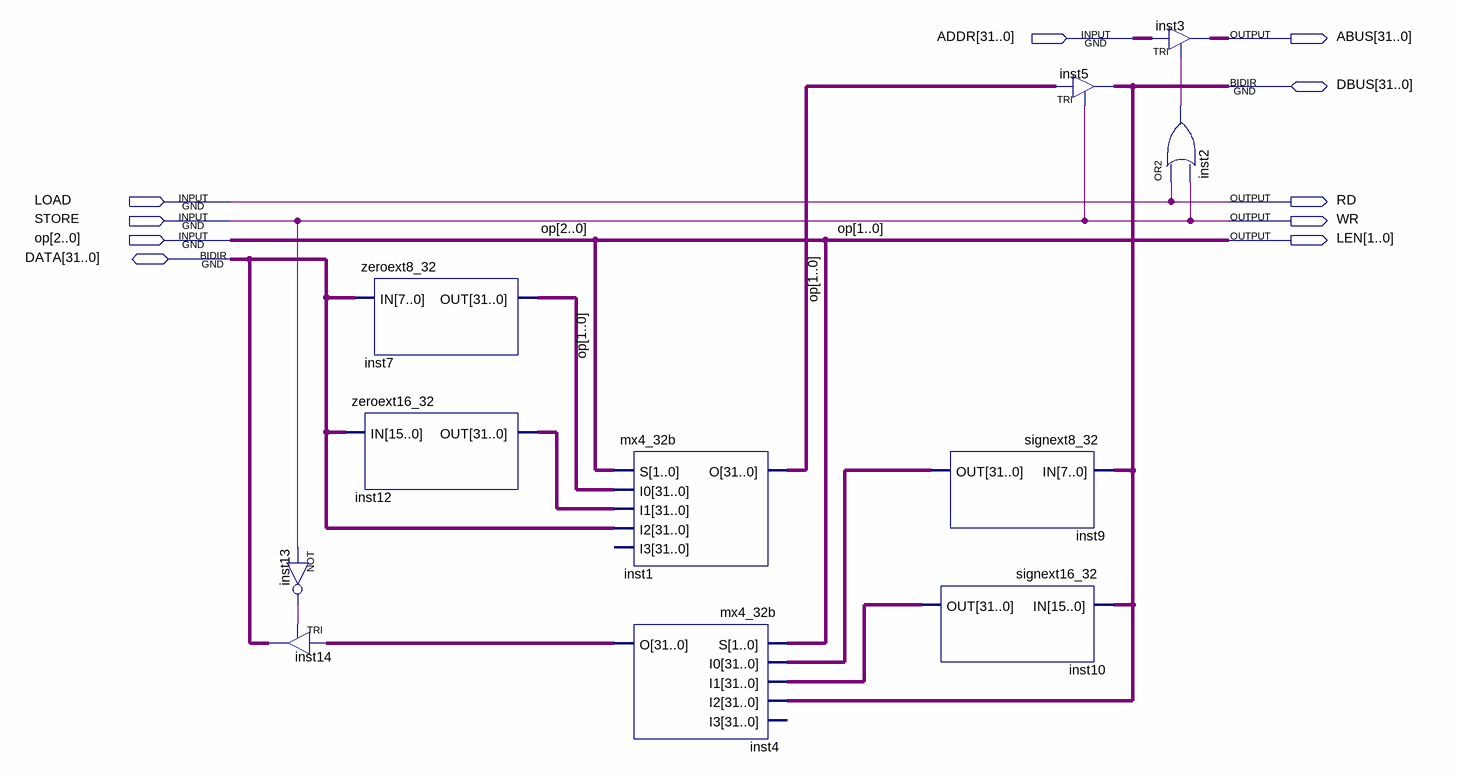
[diagram p0: schematic sheet]
// Quartus schematic bus_interface.bdf as structural Verilog: 11 symbols, 10 pins
module bus_interface (
  input  [31:0] ADDR,
  input  LOAD,
  input  STORE,
  input  [2:0] op,
  inout  [31:0] DBUS,
  inout  [31:0] DATA,
  output [31:0] ABUS,
  output RD,
  output WR,
  output [1:0] LEN
);

  wire inst2_out, inst13_out;
  wire [31:0] inst1_o, inst4_o, inst7_out, inst9_out, inst10_out, inst12_out;

  not inst13 (inst13_out, STORE);
  TRI inst14[31:0] (.IN(inst4_o), .OE(inst13_out), .OUT(DATA));
  zeroext8_32 inst7 (.IN(DATA[7:0]), .OUT(inst7_out));
  zeroext16_32 inst12 (.IN(DATA[15:0]), .OUT(inst12_out));
  mx4_32b inst1 (.S(op[1:0]), .I0(inst7_out), .I1(inst12_out), .I2(DATA), .O(inst1_o));  // open: I3
  mx4_32b inst4 (.S(op[1:0]), .I0(inst9_out), .I1(inst10_out), .I2(DBUS), .O(inst4_o));  // open: I3
  signext8_32 inst9 (.IN(DBUS[7:0]), .OUT(inst9_out));
  signext16_32 inst10 (.IN(DBUS[15:0]), .OUT(inst10_out));
  TRI inst5[31:0] (.IN(inst1_o), .OE(STORE), .OUT(DBUS));
  TRI inst3[31:0] (.IN(ADDR), .OE(inst2_out), .OUT(ABUS));
  or inst2 (inst2_out, LOAD, STORE);

  assign LEN = op[1:0];
  assign RD = LOAD;
  assign WR = STORE;
endmodule
